# EAGLE design sputnik_prototype_SysController (EAGLE 7.4.0)
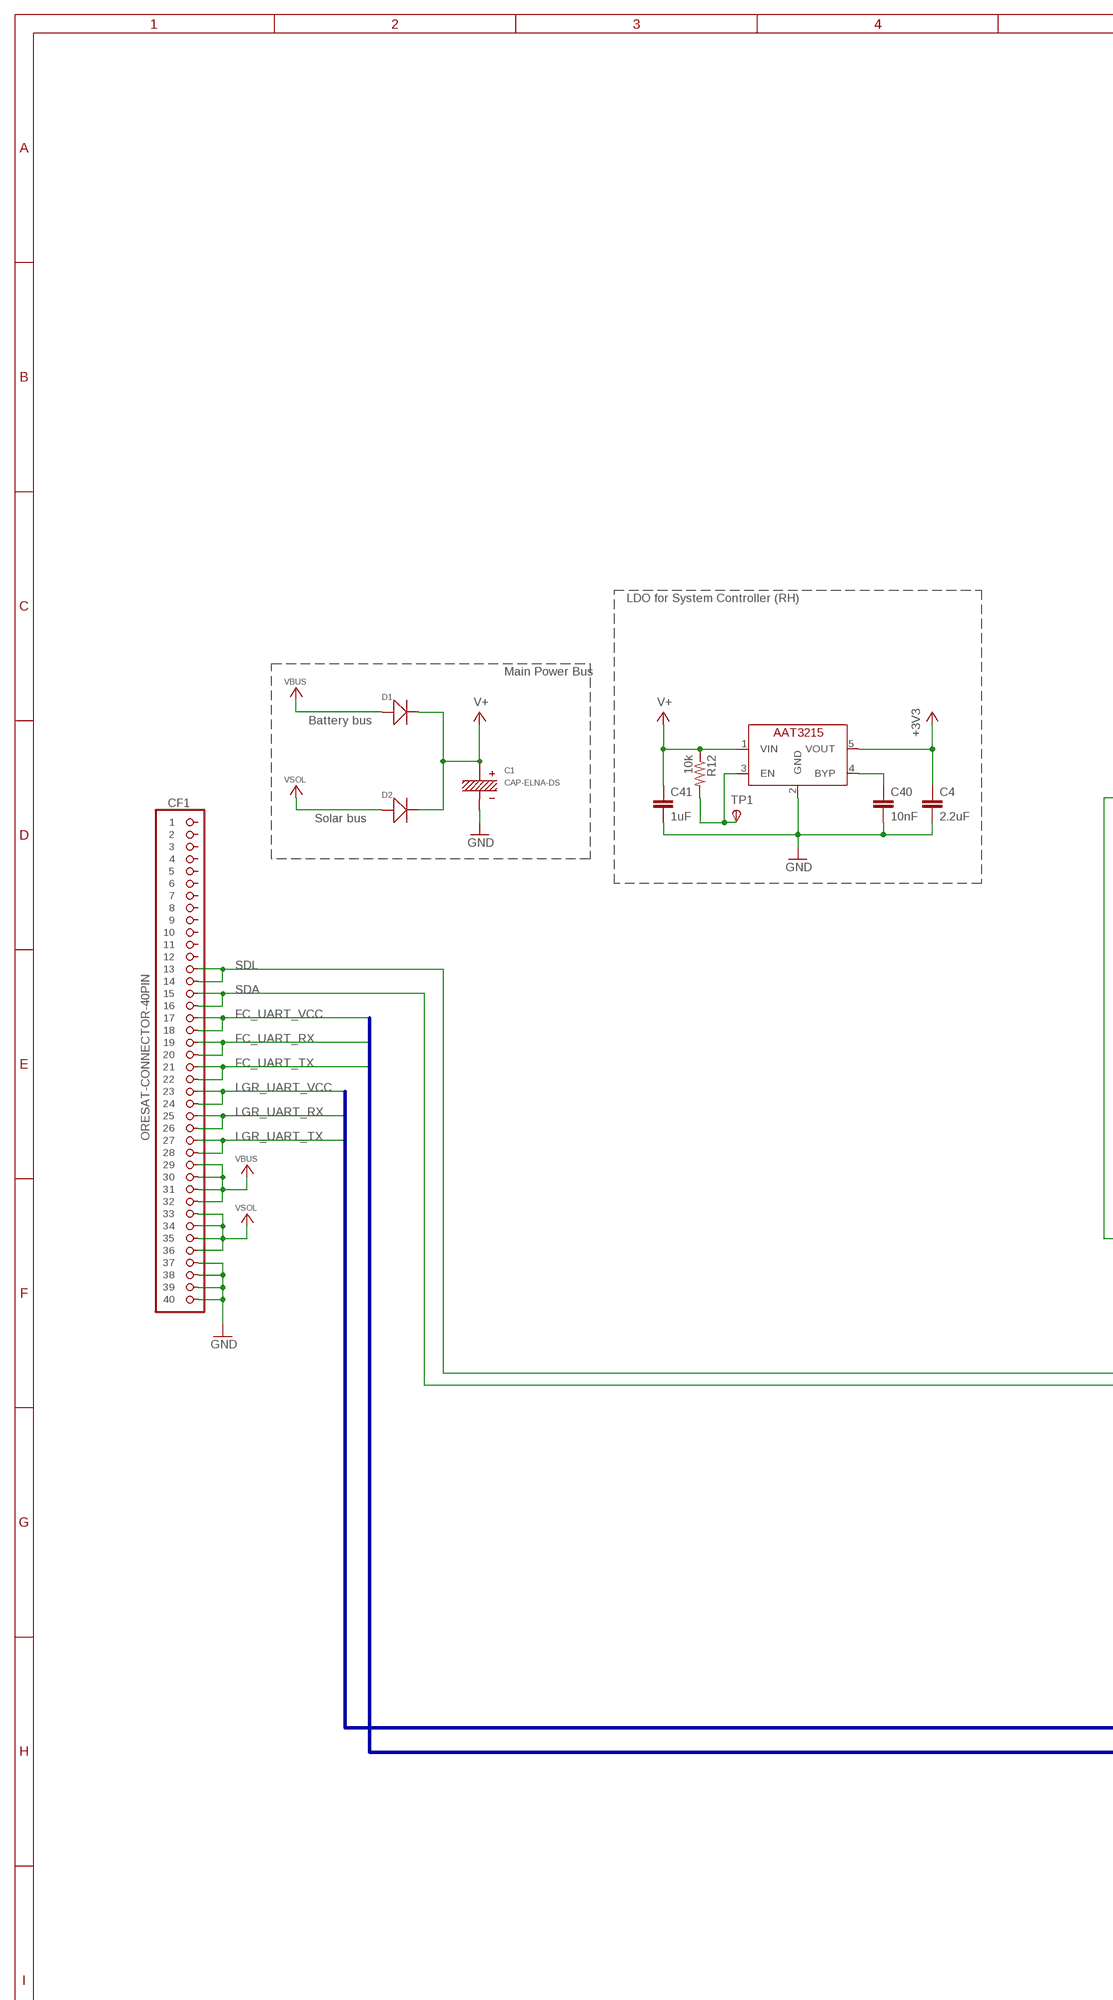
[diagram p0: schematic, sheet 1, part 1 of 2]
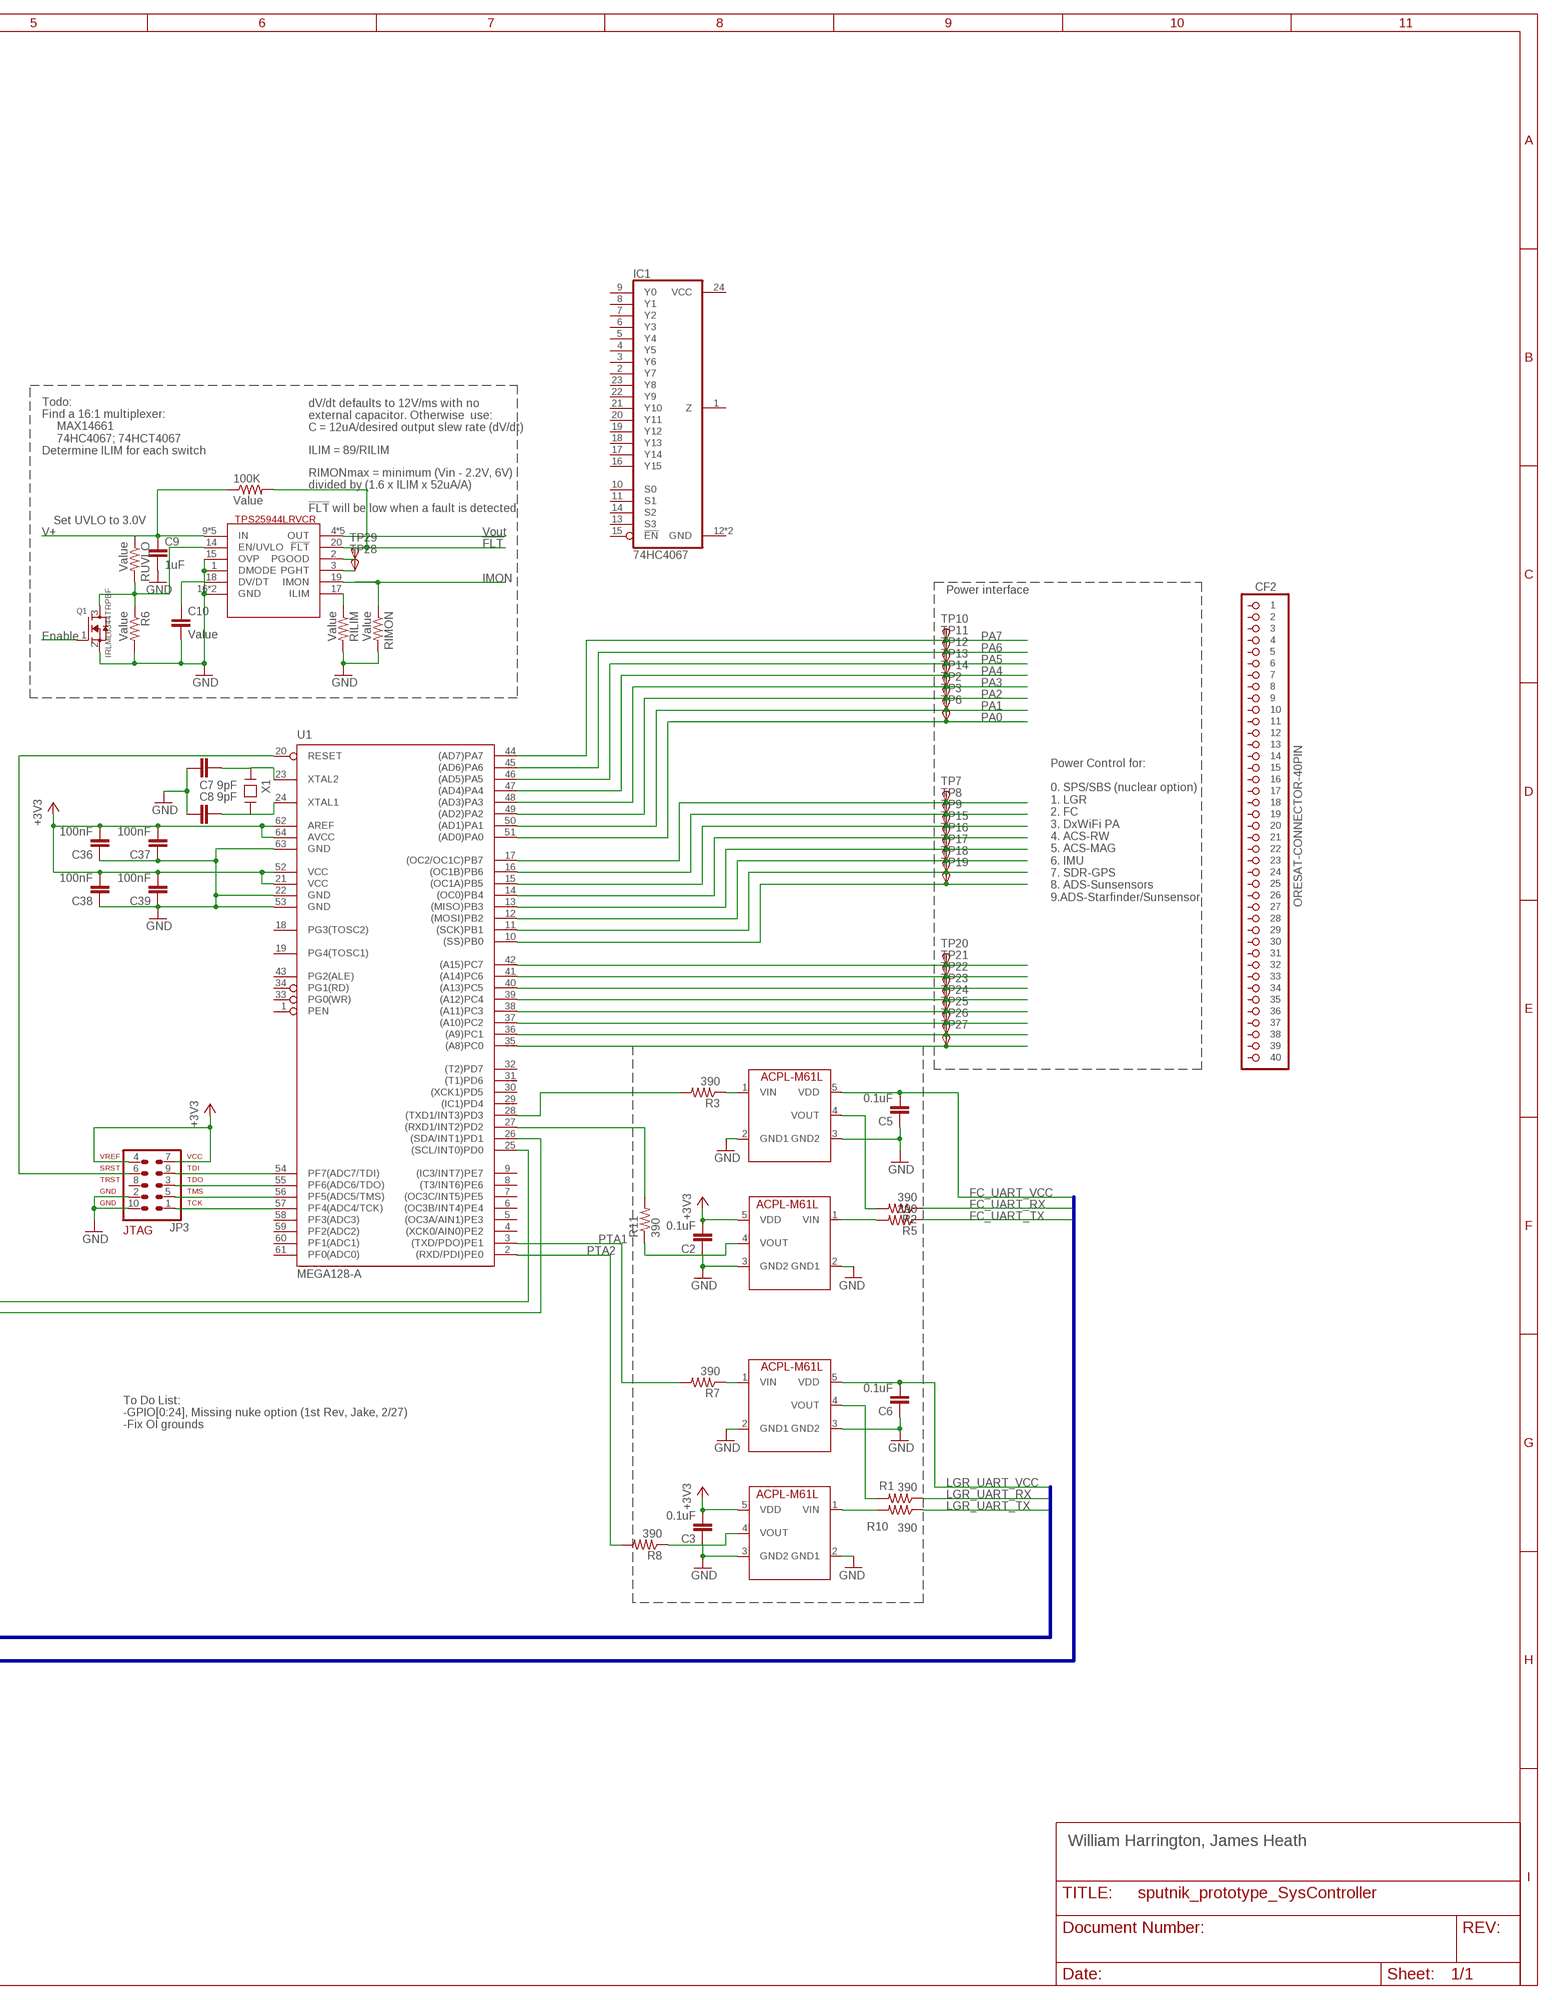
[diagram p1: schematic, sheet 1, part 2 of 2]

## Parts
100K  Value  R-US_0603-B-NOSILK  [.0603-B-NOSILK]
C1  CAP-ELNA-DS  [CAP-ELNA-DS-SERIES]
C2  0.1uF  C-EU0603-B-NOSILK  [.0603-B-NOSILK]
C3  0.1uF  C-EU0603-B-NOSILK  [.0603-B-NOSILK]
C4  2.2uF  C-EU0402-B-NOSILK  [.0402-B-NOSILK]
C5  0.1uF  C-EU0603-B-NOSILK  [.0603-B-NOSILK]
C6  0.1uF  C-EU0603-B-NOSILK  [.0603-B-NOSILK]
C7  9pF  C-EU0603-B-NOSILK  [.0603-B-NOSILK]
C8  9pF  C-EU0603-B-NOSILK  [.0603-B-NOSILK]
C9  1uF  C-EU0402-B-NOSILK  [.0402-B-NOSILK]
C10  Value  C-EU0402-B-NOSILK  [.0402-B-NOSILK]
C36  100nF  C-EU0603-B-NOSILK  [.0603-B-NOSILK]
C37  100nF  C-EU0603-B-NOSILK  [.0603-B-NOSILK]
C38  100nF  C-EU0603-B-NOSILK  [.0603-B-NOSILK]
C39  100nF  C-EU0603-B-NOSILK  [.0603-B-NOSILK]
C40  10nF  C-EU0402-B-NOSILK  [.0402-B-NOSILK]
C41  1uF  C-EU0402-B-NOSILK  [.0402-B-NOSILK]
CF1  ORESAT-CONNECTOR-40PIN  [HARWIN-ARCHER-M50-3202045]
CF2  ORESAT-CONNECTOR-40PIN  [HARWIN-ARCHER-M50-3202045]
D1  SMD-DIODE-SCHOTTKY-40V-5A(DO-214AB)-SSC53L  [DO-214AB]
D2  SMD-DIODE-SCHOTTKY-40V-5A(DO-214AB)-SSC53L  [DO-214AB]
IC1  74HC4067  [QFN-24]
JP3  AVR-JTAG-10  [AVR-JTAG-10]
Q1  IRLML6344TRPBF  [SOT23]
R1  390  R-US_0603-B-NOSILK  [.0603-B-NOSILK]
R2  390  R-US_0603-B-NOSILK  [.0603-B-NOSILK]
R3  390  R-US_0603-B-NOSILK  [.0603-B-NOSILK]
R5  390  R-US_0603-B-NOSILK  [.0603-B-NOSILK]
R6  Value  R-US_0603-B-NOSILK  [.0603-B-NOSILK]
R7  390  R-US_0603-B-NOSILK  [.0603-B-NOSILK]
R8  390  R-US_0603-B-NOSILK  [.0603-B-NOSILK]
R10  390  R-US_0603-B-NOSILK  [.0603-B-NOSILK]
R11  390  R-US_0603-B-NOSILK  [.0603-B-NOSILK]
R12  10k  R-US_0603-B-NOSILK  [.0603-B-NOSILK]
RILIM  Value  R-US_0603-B-NOSILK  [.0603-B-NOSILK]
RIMON  Value  R-US_0603-B-NOSILK  [.0603-B-NOSILK]
RUVLO  Value  R-US_0603-B-NOSILK  [.0603-B-NOSILK]
SW1  TPS25944LRVCRWQFN-20-3X4  [QFN-20-L]
TP1  TPSPAD1-13  [P1-13]
TP2  TPSPAD1-13  [P1-13]
TP3  TPSPAD1-13  [P1-13]
TP6  TPSPAD1-13  [P1-13]
TP7  TPSPAD1-13  [P1-13]
TP8  TPSPAD1-13  [P1-13]
TP9  TPSPAD1-13  [P1-13]
TP10  TPSPAD1-13  [P1-13]
TP11  TPSPAD1-13  [P1-13]
TP12  TPSPAD1-13  [P1-13]
TP13  TPSPAD1-13  [P1-13]
TP14  TPSPAD1-13  [P1-13]
TP15  TPSPAD1-13  [P1-13]
TP16  TPSPAD1-13  [P1-13]
TP17  TPSPAD1-13  [P1-13]
TP18  TPSPAD1-13  [P1-13]
TP19  TPSPAD1-13  [P1-13]
TP20  TPSPAD1-13  [P1-13]
TP21  TPSPAD1-13  [P1-13]
TP22  TPSPAD1-13  [P1-13]
TP23  TPSPAD1-13  [P1-13]
TP24  TPSPAD1-13  [P1-13]
TP25  TPSPAD1-13  [P1-13]
TP26  TPSPAD1-13  [P1-13]
TP27  TPSPAD1-13  [P1-13]
TP28  TPSPAD1-13  [P1-13]
TP29  TPSPAD1-13  [P1-13]
U1  MEGA128-A  [TQFP64]
U$1  ACPL-M61L  [ACPL-M61L]
U$2  ACPL-M61L  [ACPL-M61L]
U$3  ACPL-M61L  [ACPL-M61L]
U$4  ACPL-M61L  [ACPL-M61L]
U$8  AAT3215  [AAT3215]
X1  CRYSTAL-ABRACON-ABM3-SMD  [CRYSTAL-ABRACON-ABM3-SMD]

## Nets
+3V3: C2.2 C3.2 C4.1 C36.2 C37.2 C38.2 C39.2 JP3.4 JP3.7 U1.21(VCC) U1.52(VCC) U1.62(AREF) U1.64(AVCC) U$2.5(VDD) U$4.5(VDD) U$8.5(VOUT)
FC_UART_RX: CF1.P$19 CF1.P$20 R2.1
FC_UART_TX: CF1.P$21 CF1.P$22 R5.1
FC_UART_VCC: C5.2 CF1.P$17 CF1.P$18 U$1.5(VDD)
GND: C1.- C2.1 C3.1 C4.2 C5.1 C6.1 C7.1 C8.1 C9.2 C10.2 C36.1 C37.1 C38.1 C39.1 C40.2 C41.2 CF1.P$37 CF1.P$38 CF1.P$39 CF1.P$40 JP3.2 JP3.10 Q1.2(S) R6.2 RILIM.2 RIMON.2 SW1.1(DMODE) SW1.15(OVP) SW1.16(GND) SW1.21(GND) U1.22(GND) U1.53(GND) U1.63(GND) U$1.2(GND1) U$1.3(GND2) U$2.3(GND2) U$3.2(GND1) U$3.3(GND2) U$4.2(GND1) U$4.3(GND2) U$8.2(GND)
LGR_UART_RX: CF1.P$25 CF1.P$26 R1.1
LGR_UART_TX: CF1.P$27 CF1.P$28 R10.1
LGR_UART_VCC: C6.2 CF1.P$23 CF1.P$24 U$3.5(VDD)
N$1: C8.2 U1.24(XTAL1) X1.P$2
N$2: 100K.1 C9.1 RUVLO.1 SW1.9(IN) SW1.10(IN) SW1.11(IN) SW1.12(IN) SW1.13(IN)
N$3: SW1.4(OUT) SW1.5(OUT) SW1.6(OUT) SW1.7(OUT) SW1.8(OUT)
N$4: R7.1 U$3.1(VIN)
N$5: R2.2 U$1.4(VOUT)
N$6: R3.1 U$1.1(VIN)
N$8: R5.2 U$2.1(VIN)
N$9: Q1.3(D) R6.1 RUVLO.2 SW1.14(EN/UVLO)
N$10: R3.2 U1.28((TXD1/INT3)PD3)
N$11: JP3.1 U1.57(PF4(ADC4/TCK))
N$12: JP3.3 U1.55(PF6(ADC6/TDO))
N$13: JP3.5 U1.56(PF5(ADC5/TMS))
N$14: JP3.9 U1.54(PF7(ADC7/TDI))
N$15: JP3.6 U1.20(RESET)
N$16: R1.2 U$3.4(VOUT)
N$17: C7.2 U1.23(XTAL2) X1.P$1
N$18: R8.1 U$4.4(VOUT)
N$19: R11.2 U1.27((RXD1/INT2)PD2)
N$20: R10.2 U$4.1(VIN)
N$21: RILIM.1 SW1.17(ILIM)
N$22: R12.2 TP1.TP(PP) U$8.3(EN)
N$23: C40.1 U$8.4(BYP)
N$24: R11.1 U$2.4(VOUT)
N$25: SW1.2(PGOOD) TP29.TP(PP)
N$26: Q1.1(G)
N$27: RIMON.1 SW1.19(IMON)
N$28: SW1.3(PGHT) TP28.TP(PP)
N$29: 100K.2 SW1.20(!FLT)
N$31: C10.1 SW1.18(DV/DT)
N$36: C41.1 R12.1 U$8.1(VIN)
PA0: TP6.TP(PP) U1.51((AD0)PA0)
PA1: TP3.TP(PP) U1.50((AD1)PA1)
PA2: TP2.TP(PP) U1.49((AD2)PA2)
PA3: TP14.TP(PP) U1.48((AD3)PA3)
PA4: TP13.TP(PP) U1.47((AD4)PA4)
PA5: TP12.TP(PP) U1.46((AD5)PA5)
PA6: TP11.TP(PP) U1.45((AD6)PA6)
PA7: TP10.TP(PP) U1.44((AD7)PA7)
PB0: TP19.TP(PP) U1.10((SS)PB0)
PB1: TP18.TP(PP) U1.11((SCK)PB1)
PB2: TP17.TP(PP) U1.12((MOSI)PB2)
PB3: TP16.TP(PP) U1.13((MISO)PB3)
PB4: TP15.TP(PP) U1.14((OC0)PB4)
PB5: TP9.TP(PP) U1.15((OC1A)PB5)
PB6: TP8.TP(PP) U1.16((OC1B)PB6)
PB7: TP7.TP(PP) U1.17((OC2/OC1C)PB7)
PC0: TP27.TP(PP) U1.35((A8)PC0)
PC1: TP26.TP(PP) U1.36((A9)PC1)
PC2: TP25.TP(PP) U1.37((A10)PC2)
PC3: TP24.TP(PP) U1.38((A11)PC3)
PC4: TP23.TP(PP) U1.39((A12)PC4)
PC5: TP22.TP(PP) U1.40((A13)PC5)
PC6: TP21.TP(PP) U1.41((A14)PC6)
PC7: TP20.TP(PP) U1.42((A15)PC7)
PTA1: R7.2 U1.3((TXD/PDO)PE1)
PTA2: R8.2 U1.2((RXD/PDI)PE0)
SDA: CF1.P$15 CF1.P$16 U1.26((SDA/INT1)PD1)
SDL: CF1.P$13 CF1.P$14 U1.25((SCL/INT0)PD0)
V+: C1.+ D1.2(-) D2.2(-)
VBUS: CF1.P$29 CF1.P$30 CF1.P$31 CF1.P$32 D1.1(+)
VSOL: CF1.P$33 CF1.P$34 CF1.P$35 CF1.P$36 D2.1(+)
Unconnected: CF1.P$1 CF1.P$2 CF1.P$3 CF1.P$4 CF1.P$5 CF1.P$6 CF1.P$7 CF1.P$8 CF1.P$9 CF1.P$10 CF1.P$11 CF1.P$12 CF2.P$1 CF2.P$2 CF2.P$3 CF2.P$4 CF2.P$5 CF2.P$6 CF2.P$7 CF2.P$8 CF2.P$9 CF2.P$10 CF2.P$11 CF2.P$12 CF2.P$13 CF2.P$14 CF2.P$15 CF2.P$16 CF2.P$17 CF2.P$18 CF2.P$19 CF2.P$20 CF2.P$21 CF2.P$22 CF2.P$23 CF2.P$24 CF2.P$25 CF2.P$26 CF2.P$27 CF2.P$28 CF2.P$29 CF2.P$30 CF2.P$31 CF2.P$32 CF2.P$33 CF2.P$34 CF2.P$35 CF2.P$36 CF2.P$37 CF2.P$38 CF2.P$39 CF2.P$40 IC1.1(Z) IC1.2(Y7) IC1.3(Y6) IC1.4(Y5) IC1.5(Y4) IC1.6(Y3) IC1.7(Y2) IC1.8(Y1) IC1.9(Y0) IC1.10(S0) IC1.11(S1) IC1.12(GND) IC1.13(S3) IC1.14(S2) IC1.15(!EN) IC1.16(Y15) IC1.17(Y14) IC1.18(Y13) IC1.19(Y12) IC1.20(Y11) IC1.21(Y10) IC1.22(Y9) IC1.23(Y8) IC1.24(VCC) IC1.25(GND) JP3.8 U1.1(PEN) U1.4((XCK0/AIN0)PE2) U1.5((OC3A/AIN1)PE3) U1.6((OC3B/INT4)PE4) U1.7((OC3C/INT5)PE5) U1.8((T3/INT6)PE6) U1.9((IC3/INT7)PE7) U1.18(PG3(TOSC2)) U1.19(PG4(TOSC1)) U1.29((IC1)PD4) U1.30((XCK1)PD5) U1.31((T1)PD6) U1.32((T2)PD7) U1.33(PG0(WR)) U1.34(PG1(RD)) U1.43(PG2(ALE)) U1.58(PF3(ADC3)) U1.59(PF2(ADC2)) U1.60(PF1(ADC1)) U1.61(PF0(ADC0)) U$2.2(GND1)

## Buses
LGR_UART_VCC,LGR_UART_RX,LGR_UART_TX
FC_UART_VCC,FC_UART_RX,FC_UART_TX

## Notes on the sheet
- dV/dt defaults to 12V/ms with no
  external capacitor. Otherwise  use:
  C = 12uA/desired output slew rate (dV/dt)
- Todo:
  Find a 16:1 multiplexer:
       MAX14661 
       74HC4067; 74HCT4067  
  Determine ILIM for each switch
- ILIM = 89/RILIM
- RIMONmax = minimum (Vin - 2.2V, 6V)
  divided by (1.6 x ILIM x 52uA/A)
- Set UVLO to 3.0V | !FLT! will be low when a fault is detected
- V+ | Vout
- !FLT
- LDO for System Controller (RH)
- IMON
- Power interface
- Main Power Bus | Enable
- Battery bus
- Solar bus
- Power Control for:
  
  0. SPS/SBS (nuclear option)
  1. LGR
  2. FC
  3. DxWiFi PA
  4. ACS-RW
  5. ACS-MAG
  6. IMU
  7. SDR-GPS
  8. ADS-Sunsensors
  9.ADS-Starfinder/Sunsensor
- To Do List:
  -GPIO[0:24], Missing nuke option (1st Rev, Jake, 2/27)
  -Fix OI grounds
- William Harrington, James Heath

## Library data of the parts
100K R1-R3 R5-R8 R10-R12 RILIM RIMON RUVLO = rcl_custom:R-US_: RESISTOR, American symbol
C1 = cap-elna-ds:CAP-ELNA-DS
C2-C10 C36-C41 = rcl_custom:C-EU: CAPACITOR, European symbol
CF1 CF2 = oresat-eagle:ORESAT-CONNECTOR-40PIN: OreSat 40pin card connector. Uses the Harwin Archer M50-3202045.
D1 D2 = SMD-DIODE-SCHOTTKY-40V-5A_DO-214AB_ SSC53L:SMD-DIODE-SCHOTTKY-40V-5A(DO-214AB)-SSC53L: SSC53L 5A, .45V Turn on
IC1 = QFN-24:74HC4067
JP3 = Vibrogait_prototype:AVR-JTAG-10: AVR JTAG Debug/Programming Header
Q1 = adafruit:IRLML6344TRPBF
SW1 = WQFN-20-3x4:TPS25944LRVCR
TP1-TP3 TP6-TP29 = testpad:TPS: TEST PIN
U1 = atmel:MEGA128: MICROCONTROLLER 128 Kbytes FLASH 4 Kbytes SRAM 4 Kbytes EEPROM DUAL USART 8-channel 10 bit ADC Source: avr.lbr; MFN: Atmel; MPN: ATMEGA128-16AU; OC_FARNELL: 9171118; OC_NEWARK: 95K7364
U$1-U$4 = psas_c3_team05:ACPL-M61L
U$8 = psas_c3_team05:AAT3215; MFN: Skyworks; MFN-PN: AAT3215
X1 = crystal-abracon-abm3-smd:CRYSTAL-ABRACON-ABM3-SMD: Abracon ABM3-8.000MHz-D2Y-T

## Board
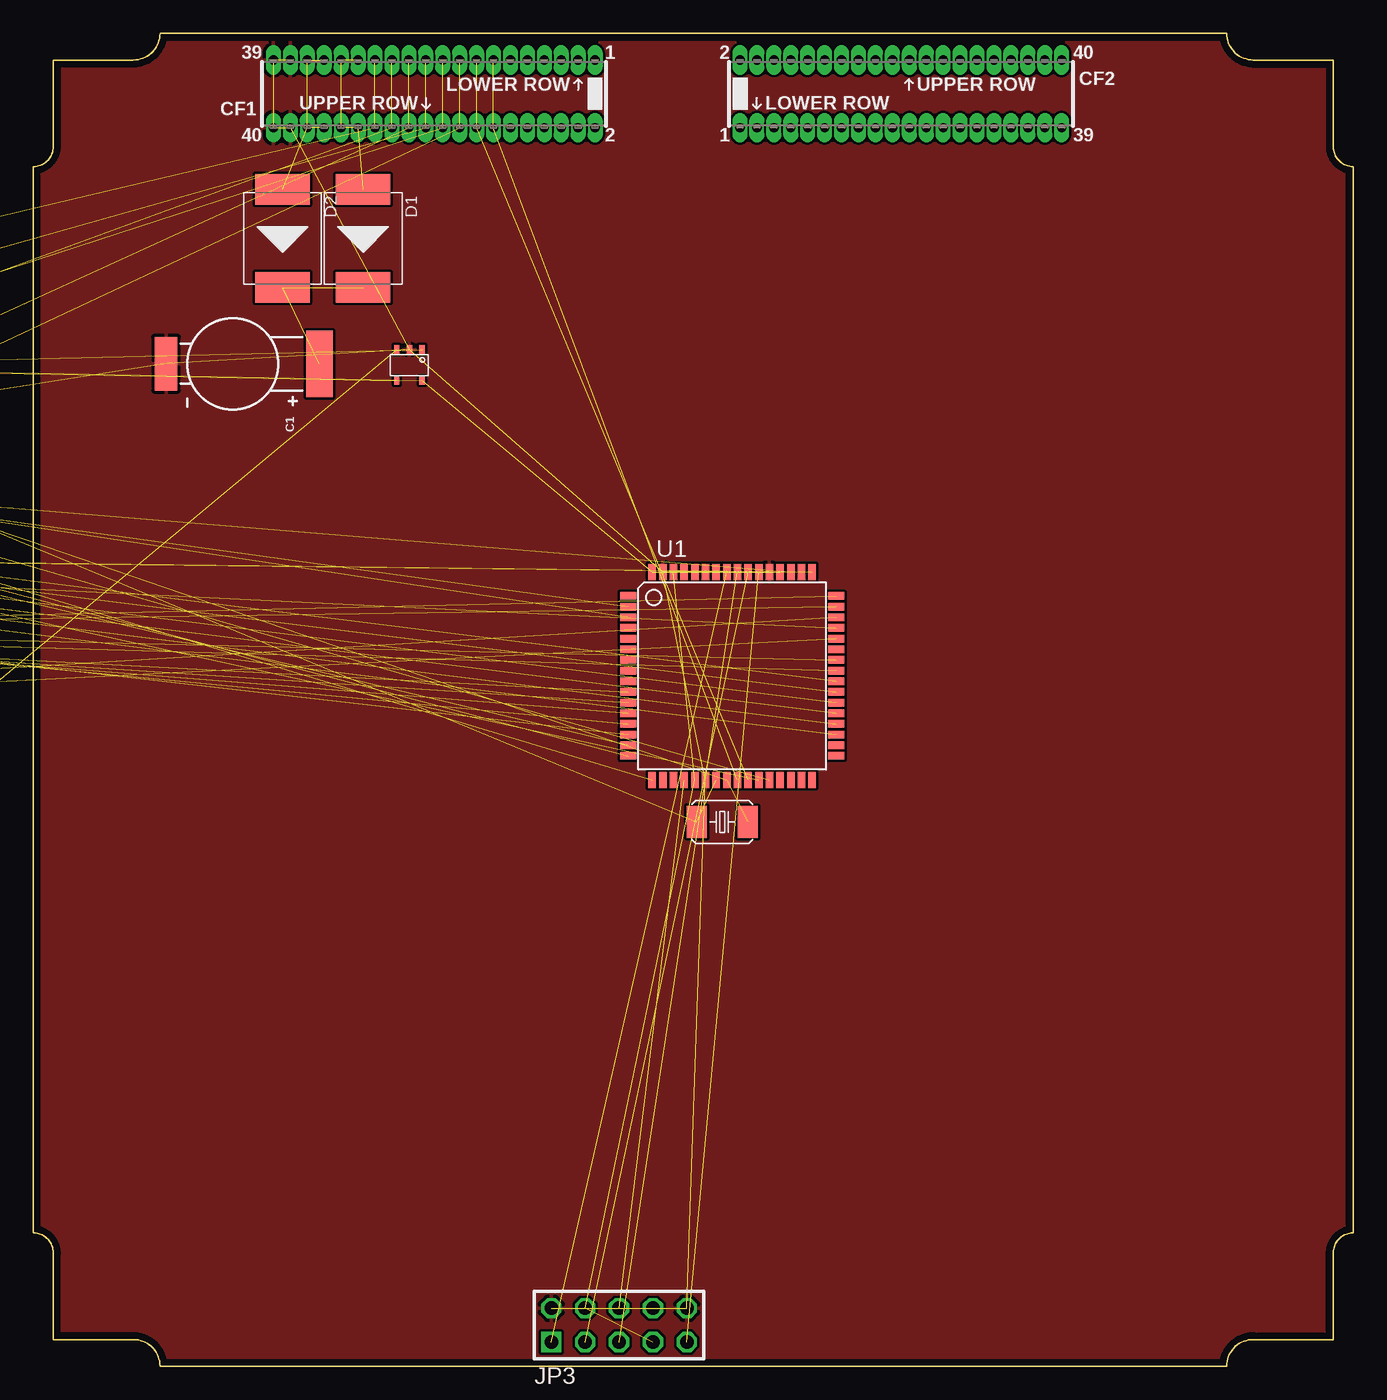
[diagram p2: board, top side]
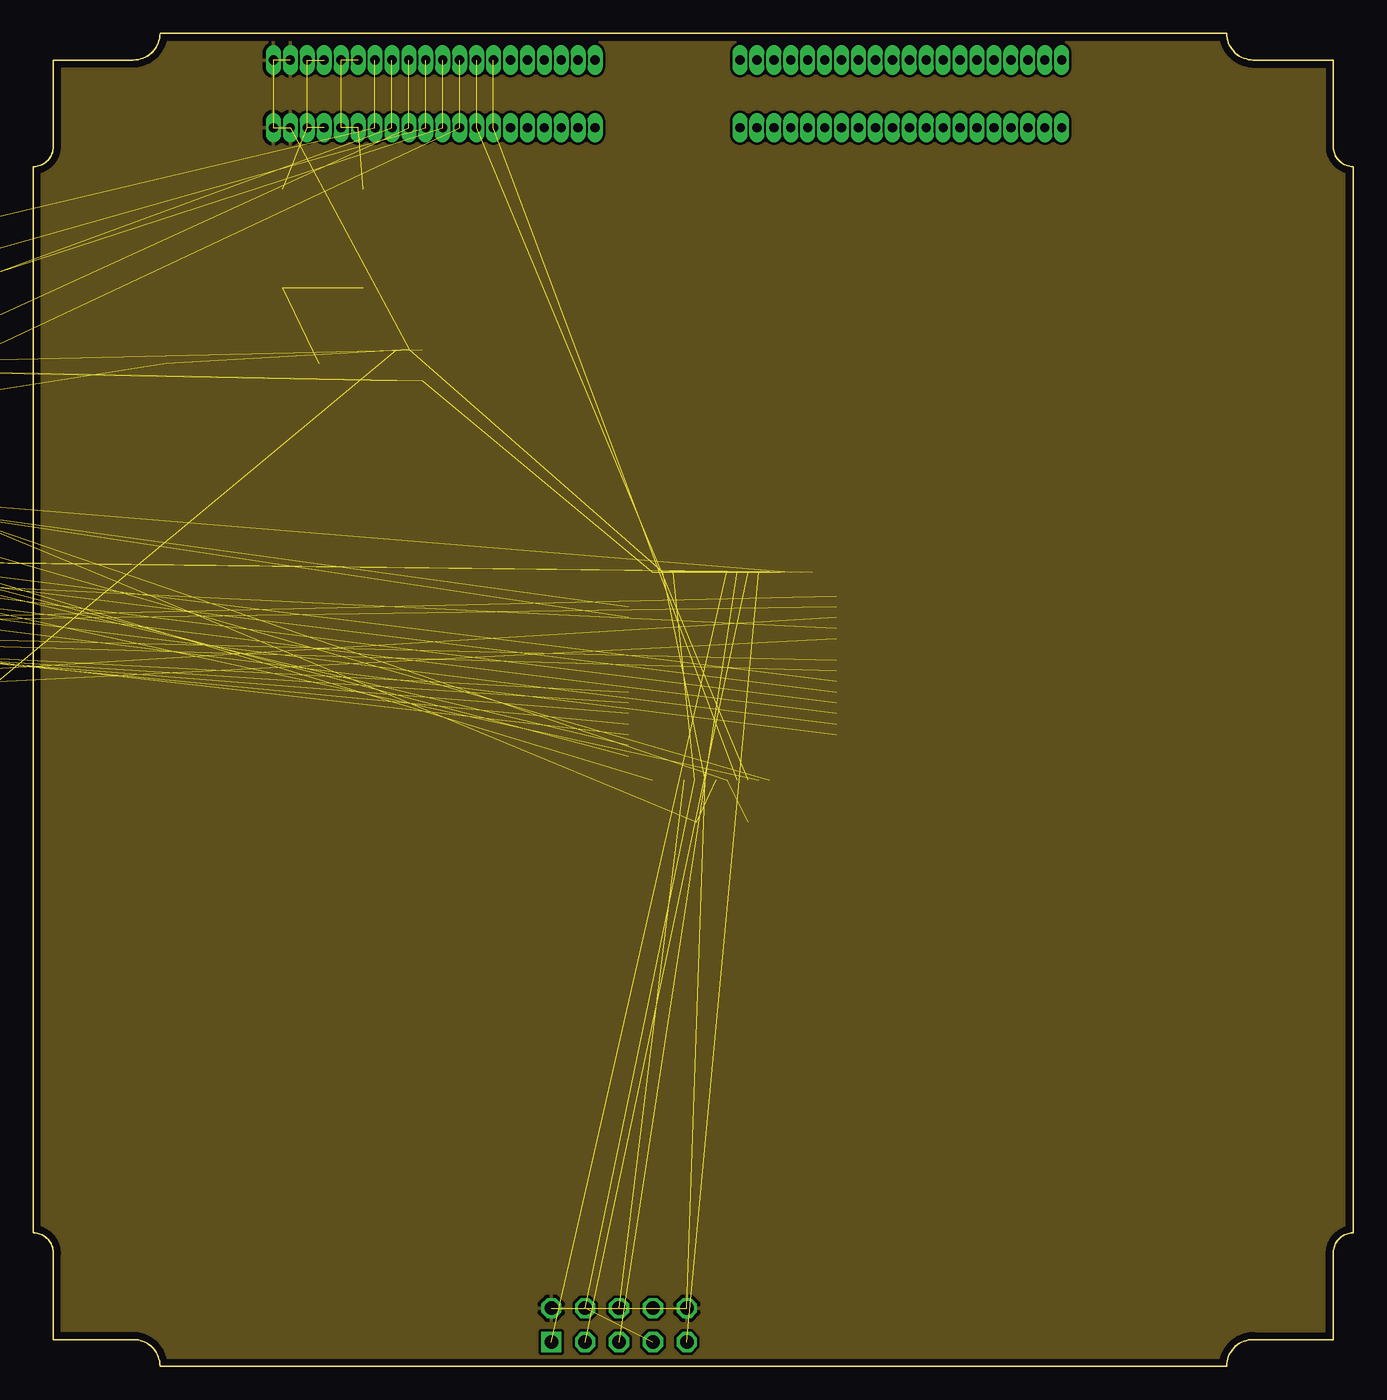
[diagram p3: board, inner layer Route2]
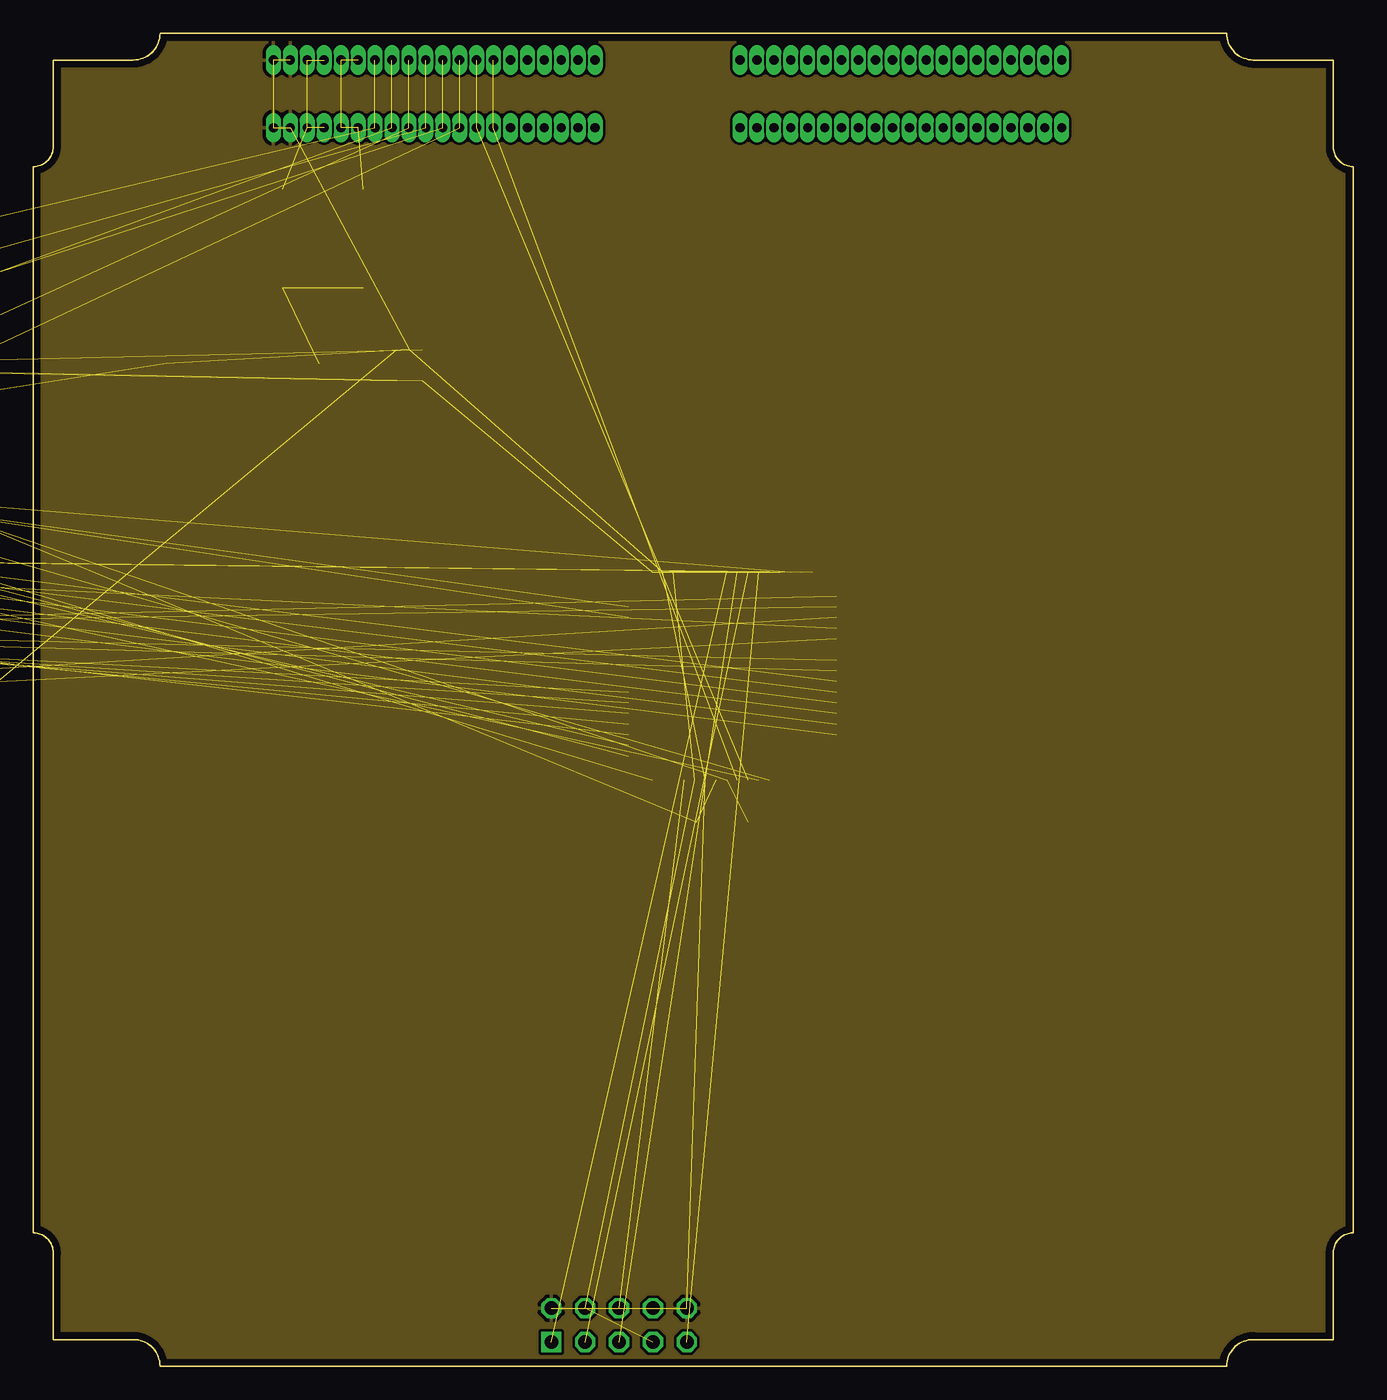
[diagram p4: board, inner layer Route15]
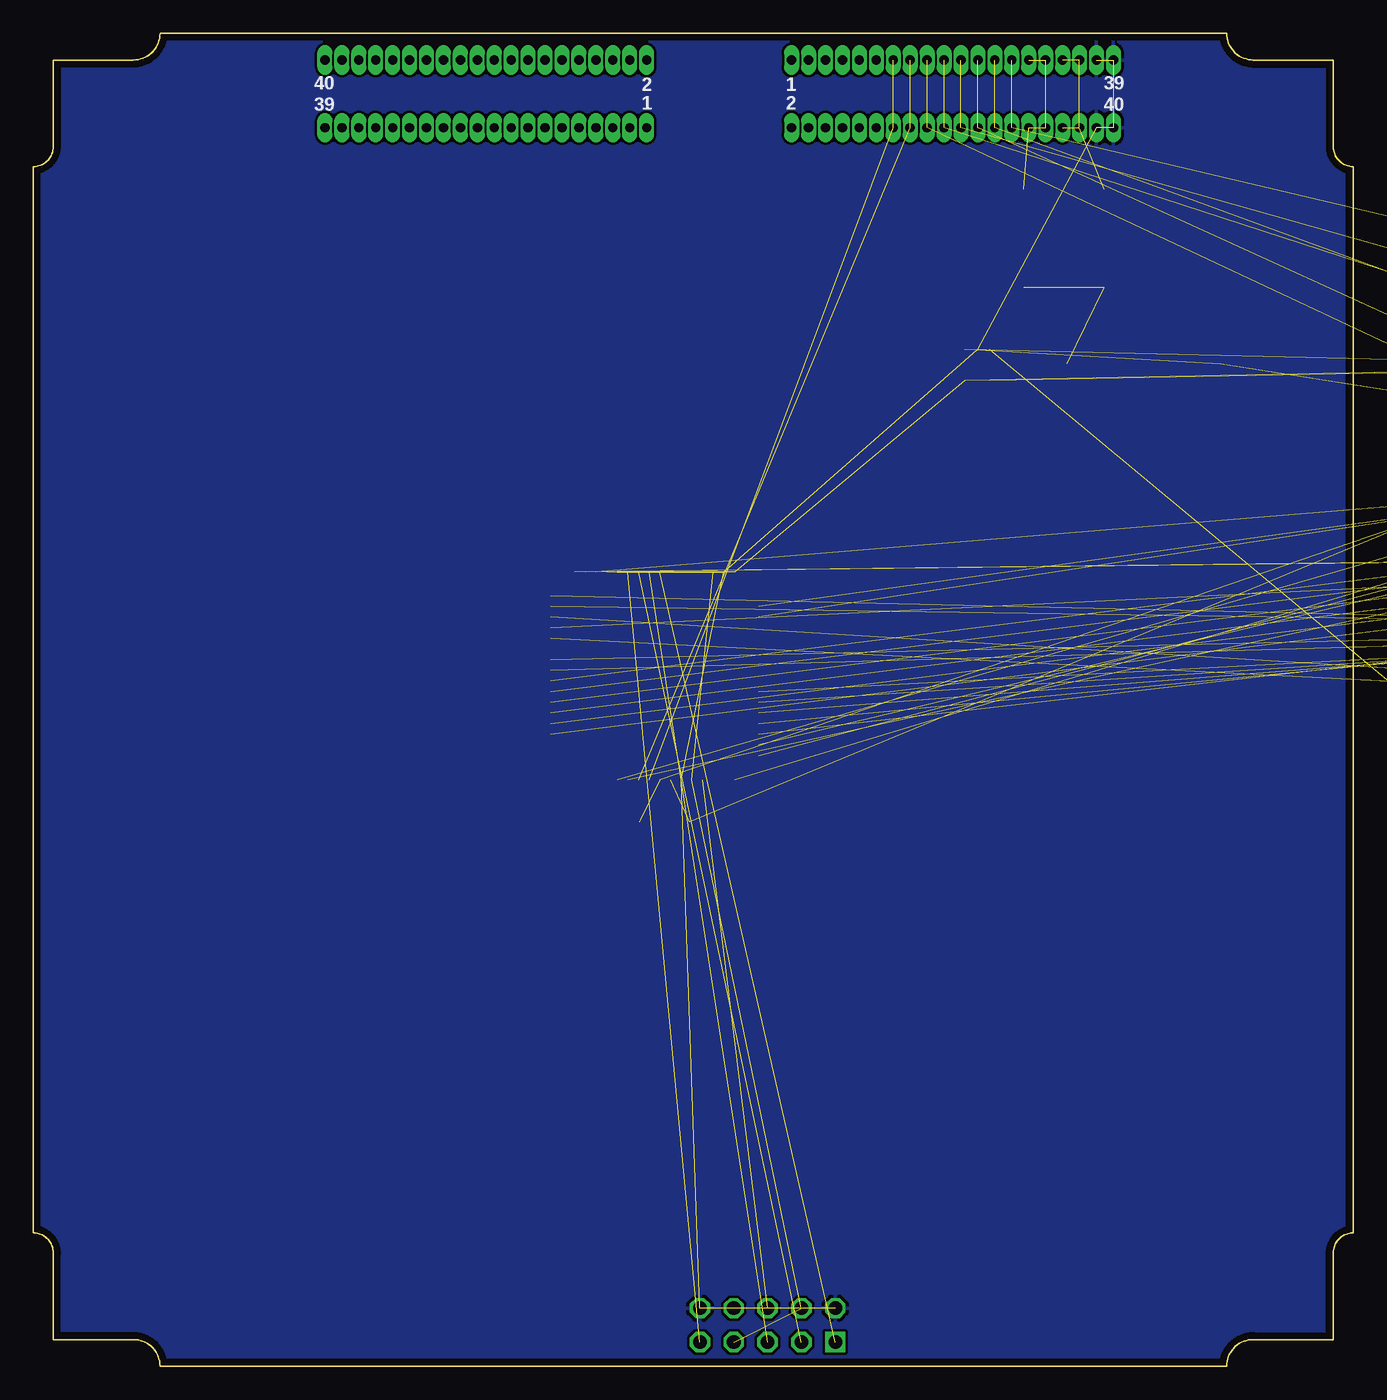
[diagram p5: board, bottom side, seen from below]

Size 99 x 100 mm. Coordinates in mm from the lower left corner, seen from the top.
Copper layers (1+2*15+16): Top 0.0178mm / dielectric 12mil / Route2 0.0356mm / dielectric 28mil / Route15 0.0356mm / dielectric 12mil / Bottom 0.0178mm
Design rules "sunstone-4Lyr_v1.0.0.3": minimum track width 6mil, minimum drill 8mil, track to track 6mil, track to pad 6mil, pad to pad 6mil, via to via 6mil, smd to smd 6mil, copper to edge 20mil, drill to drill 16mil, minimum pad ring 8mil, minimum via ring 8mil, stop-mask expansion 3mil, vias tented up to drill 0mil, thermal gap 10mil

### Footprints (pad centres in the part's own frame; a part is rotated, then mirrored left to right if it is on the bottom)
.0603-B-NOSILK = smd 0.8 x 0.95: 1 -0.8,0; 2 0.8,0
CAP-ELNA-DS-SERIES = smd 5 x 2: + 0,6.5 | smd 4 x 1.7: - 0,-5
.0402-B-NOSILK = smd 0.6 x 0.7: 1 -0.5,0; 2 0.5,0
HARWIN-ARCHER-M50-3202045 = drill 0.7 pad 1.07 long: P$1 -12.065,-2.54; P$2 -12.065,2.54; P$3 -10.795,-2.54; P$4 -10.795,2.54; P$5 -9.525,-2.54; P$6 -9.525,2.54; P$7 -8.255,-2.54; P$8 -8.255,2.54; P$9 -6.985,-2.54; P$10 -6.985,2.54; P$11 -5.715,-2.54; P$12 -5.715,2.54; P$13 -4.445,-2.54; P$14 -4.445,2.54; P$15 -3.175,-2.54; P$16 -3.175,2.54; P$17 -1.905,-2.54; P$18 -1.905,2.54; P$19 -0.635,-2.54; P$20 -0.635,2.54; P$21 0.635,-2.54; P$22 0.635,2.54; P$23 1.905,-2.54; P$24 1.905,2.54; P$25 3.175,-2.54; P$26 3.175,2.54; P$27 4.445,-2.54; P$28 4.445,2.54; P$29 5.715,-2.54; P$30 5.715,2.54; P$31 6.985,-2.54; P$32 6.985,2.54; P$33 8.255,-2.54; P$34 8.255,2.54; P$35 9.525,-2.54; P$36 9.525,2.54; P$37 10.795,-2.54; P$38 10.795,2.54; P$39 12.065,-2.54; P$40 12.065,2.54
DO-214AB = smd 2.286 x 4.064: 1 -3.683,0; 2 3.683,0
QFN-24 = smd 0.813 x 0.305: 1 -1.943,1.27; 2 -1.943,0.762; 3 -1.943,0.254; 4 -1.943,-0.254; 5 -1.943,-0.762; 6 -1.943,-1.27; 13 1.943,-1.27; 14 1.943,-0.762; 15 1.943,-0.254; 16 1.943,0.254; 17 1.943,0.762; 18 1.943,1.27 | smd 0.305 x 0.813: 7 -1.27,-1.943; 8 -0.762,-1.943; 9 -0.254,-1.943; 10 0.254,-1.943; 11 0.762,-1.943; 12 1.27,-1.943; 19 1.27,1.943; 20 0.762,1.943; 21 0.254,1.943; 22 -0.254,1.943; 23 -0.762,1.943; 24 -1.27,1.943 | smd 2.642 x 2.642: 25 0,0
AVR-JTAG-10 = drill 1.016 square: 1 -5.08,-1.27 | drill 1.016 octagon: 2 -5.08,1.27; 3 -2.54,-1.27; 4 -2.54,1.27; 5 0,-1.27; 6 0,1.27; 7 2.54,-1.27; 8 2.54,1.27; 9 5.08,-1.27; 10 5.08,1.27
SOT23 = smd 1 x 1.4: 1 -0.95,-1.1; 2 0.95,-1.1; 3 0,1.1
QFN-20-L = smd 0.2 x 0.6: 1 -1.252,-1.395; 2 -0.752,-1.395; 3 -0.252,-1.395; 4 0.248,-1.395; 5 0.748,-1.395; 6 1.248,-1.395; 11 1.248,1.405; 12 0.748,1.405; 13 0.248,1.405; 14 -0.252,1.405; 15 -0.752,1.405; 16 -1.252,1.405 | smd 0.6 x 0.2: 7 1.905,-0.748; 8 1.905,-0.248; 9 1.905,0.252; 10 1.905,0.752; 17 -1.908,0.755; 18 -1.91,0.25; 19 -1.905,-0.248; 20 -1.905,-0.748 | smd 2.6 x 1.6: 21 0,0
P1-13 = drill 1.321 pad 2.159 octagon: TP 0,0
TQFP64 = smd 1.194 x 0.559: 1 -7.8,6; 2 -7.8,5.2; 3 -7.8,4.4; 4 -7.8,3.6; 5 -7.8,2.8; 6 -7.8,2; 7 -7.8,1.2; 8 -7.8,0.4; 9 -7.8,-0.4; 10 -7.8,-1.2; 11 -7.8,-2; 12 -7.8,-2.8; 13 -7.8,-3.6; 14 -7.8,-4.4; 15 -7.8,-5.2; 16 -7.8,-6; 33 7.8,-6; 34 7.8,-5.2; 35 7.8,-4.4; 36 7.8,-3.6; 37 7.8,-2.8; 38 7.8,-2; 39 7.8,-1.2; 40 7.8,-0.4; 41 7.8,0.4; 42 7.8,1.2; 43 7.8,2; 44 7.8,2.8; 45 7.8,3.6; 46 7.8,4.4; 47 7.8,5.2; 48 7.8,6 | smd 0.559 x 1.194: 17 -6,-7.8; 18 -5.2,-7.8; 19 -4.4,-7.8; 20 -3.6,-7.8; 21 -2.8,-7.8; 22 -2,-7.8; 23 -1.2,-7.8; 24 -0.4,-7.8; 25 0.4,-7.8; 26 1.2,-7.8; 27 2,-7.8; 28 2.8,-7.8; 29 3.6,-7.8; 30 4.4,-7.8; 31 5.2,-7.8; 32 6,-7.8; 49 6,7.8; 50 5.2,7.8; 51 4.4,7.8; 52 3.6,7.8; 53 2.8,7.8; 54 2,7.8; 55 1.2,7.8; 56 0.4,7.8; 57 -0.4,7.8; 58 -1.2,7.8; 59 -2,7.8; 60 -2.8,7.8; 61 -3.6,7.8; 62 -4.4,7.8; 63 -5.2,7.8; 64 -6,7.8
ACPL-M61L = smd 0.64 x 1.8: 1 0.65,-5.56; 2 3.19,-5.56; 3 3.19,1.17; 4 1.92,1.17; 5 0.65,1.17
AAT3215 = smd 0.4 x 0.625: 1 2.375,0.38; 2 1.425,0.38; 3 0.475,0.38; 4 0.475,-1.95; 5 2.375,-1.95
CRYSTAL-ABRACON-ABM3-SMD = smd 1.5 x 2.4: P$1 -1.9,0; P$2 1.9,0

### Placement (x,y rotation side)
100K  -79,-77 0 top  (outside the outline)
C1  14.95,75.21 270 top
C2  -62.23,66.04 0 top  (outside the outline)
C3  -67.31,66.04 0 top  (outside the outline)
C4  -20.32,74.93 0 top  (outside the outline)
C5  -15.24,71.12 0 top  (outside the outline)
C6  -20.32,71.12 0 top  (outside the outline)
C7  -24.13,71.12 0 top  (outside the outline)
C8  -27.94,71.12 0 top  (outside the outline)
C9  -80,-37 0 top  (outside the outline)
C10  -80,-65 0 top  (outside the outline)
C36  -41.91,66.04 0 top  (outside the outline)
C37  -46.99,66.04 0 top  (outside the outline)
C38  -52.07,66.04 0 top  (outside the outline)
C39  -57.15,66.04 0 top  (outside the outline)
C40  -24.13,74.93 0 top  (outside the outline)
C41  -27.94,74.93 0 top  (outside the outline)
CF1  30.07,95.46 180 top
CF2  65.06,95.46 0 top
D1  24.73,84.61 270 top
D2  18.69,84.61 270 top
IC1  -77,-83 0 top  (outside the outline)
JP3  43.93,3.08 0 top
Q1  -78,-71 0 top  (outside the outline)
R1  -31.75,71.12 0 top  (outside the outline)
R2  -35.56,71.12 0 top  (outside the outline)
R3  -39.37,71.12 0 top  (outside the outline)
R5  -46.99,71.12 0 top  (outside the outline)
R6  -69,-20 0 top  (outside the outline)
R7  -54.61,71.12 0 top  (outside the outline)
R8  -58.42,71.12 0 top  (outside the outline)
R10  -66.04,71.12 0 top  (outside the outline)
R11  -69.85,71.12 0 top  (outside the outline)
R12  -69.8,-3.8 0 top  (outside the outline)
RILIM  -79,-24 0 top  (outside the outline)
RIMON  -79,-28 0 top  (outside the outline)
RUVLO  -69,-16 0 top  (outside the outline)
SW1  -67,-12 0 top  (outside the outline)
TP1  -69.7,-8.9 0 top  (outside the outline)
TP2  -59.69,60.96 0 top  (outside the outline)
TP3  -64.77,60.96 0 top  (outside the outline)
TP6  -21.59,66.04 0 top  (outside the outline)
TP7  -26.67,66.04 0 top  (outside the outline)
TP8  -31.75,66.04 0 top  (outside the outline)
TP9  -36.83,66.04 0 top  (outside the outline)
TP10  -63.5,48.26 0 top  (outside the outline)
TP11  -54.61,60.96 0 top  (outside the outline)
TP12  -69.85,48.26 0 top  (outside the outline)
TP13  -16.51,55.88 0 top  (outside the outline)
TP14  -22.86,55.88 0 top  (outside the outline)
TP15  -29.21,55.88 0 top  (outside the outline)
TP16  -35.56,55.88 0 top  (outside the outline)
TP17  -41.91,55.88 0 top  (outside the outline)
TP18  -48.26,55.88 0 top  (outside the outline)
TP19  -54.61,55.88 0 top  (outside the outline)
TP20  -60.96,55.88 0 top  (outside the outline)
TP21  -67.31,55.88 0 top  (outside the outline)
TP22  -16.51,60.96 0 top  (outside the outline)
TP23  -22.86,60.96 0 top  (outside the outline)
TP24  -29.21,60.96 0 top  (outside the outline)
TP25  -35.56,60.96 0 top  (outside the outline)
TP26  -41.91,60.96 0 top  (outside the outline)
TP27  -48.26,60.96 0 top  (outside the outline)
TP28  -79,-47 0 top  (outside the outline)
TP29  -79,-52 0 top  (outside the outline)
U1  52.41,51.79 0 top
U$1  -50.8,35.56 0 top  (outside the outline)
U$2  -55.88,35.56 0 top  (outside the outline)
U$3  -60.96,35.56 0 top  (outside the outline)
U$4  -66.04,35.56 0 top  (outside the outline)
U$5  [ORESAT-CARD-V0.3]  0,0 0 top
U$8  26.78,75.9 0 top
X1  51.67,40.83 0 top

### Tracks (layer width: path | path; a pad name or v marks a point on that pad's centre or on a via)
+3V3  (15 unrouted)
FC_UART_RX  (2 unrouted)
FC_UART_TX  (2 unrouted)
FC_UART_VCC  (3 unrouted)
GND  (40 unrouted)
  pour Top (isolate 0.2): 0,0 0,100 87.3,100 99,100 99,10.6 99,0
  pour Bottom (isolate 0.2): 0,0 0,100 87.3,100 99,100 99,10.6 99,0
  pour Route2 (isolate 0.2): 0,0 0,100 87.3,100 99,100 99,10.6 99,0
  pour Route15 (isolate 0.2): 0,0 0,100 87.3,100 99,100 99,10.6 99,0
LGR_UART_RX  (2 unrouted)
LGR_UART_TX  (2 unrouted)
LGR_UART_VCC  (3 unrouted)
N$1  (2 unrouted)
N$2  (7 unrouted)
N$3  (4 unrouted)
N$4  (1 unrouted)
N$5  (1 unrouted)
N$6  (1 unrouted)
N$8  (1 unrouted)
N$9  (3 unrouted)
N$10  (1 unrouted)
N$11  (1 unrouted)
N$12  (1 unrouted)
N$13  (1 unrouted)
N$14  (1 unrouted)
N$15  (1 unrouted)
N$16  (1 unrouted)
N$17  (2 unrouted)
N$18  (1 unrouted)
N$19  (1 unrouted)
N$20  (1 unrouted)
N$21  (1 unrouted)
N$22  (2 unrouted)
N$23  (1 unrouted)
N$24  (1 unrouted)
N$25  (1 unrouted)
N$27  (1 unrouted)
N$28  (1 unrouted)
N$29  (1 unrouted)
N$31  (1 unrouted)
N$36  (2 unrouted)
PA0  (1 unrouted)
PA1  (1 unrouted)
PA2  (1 unrouted)
PA3  (1 unrouted)
PA4  (1 unrouted)
PA5  (1 unrouted)
PA6  (1 unrouted)
PA7  (1 unrouted)
PB0  (1 unrouted)
PB1  (1 unrouted)
PB2  (1 unrouted)
PB3  (1 unrouted)
PB4  (1 unrouted)
PB5  (1 unrouted)
PB6  (1 unrouted)
PB7  (1 unrouted)
PC0  (1 unrouted)
PC1  (1 unrouted)
PC2  (1 unrouted)
PC3  (1 unrouted)
PC4  (1 unrouted)
PC5  (1 unrouted)
PC6  (1 unrouted)
PC7  (1 unrouted)
PTA1  (1 unrouted)
PTA2  (1 unrouted)
SDA  (2 unrouted)
SDL  (2 unrouted)
V+  (2 unrouted)
VBUS  (4 unrouted)
VSOL  (4 unrouted)